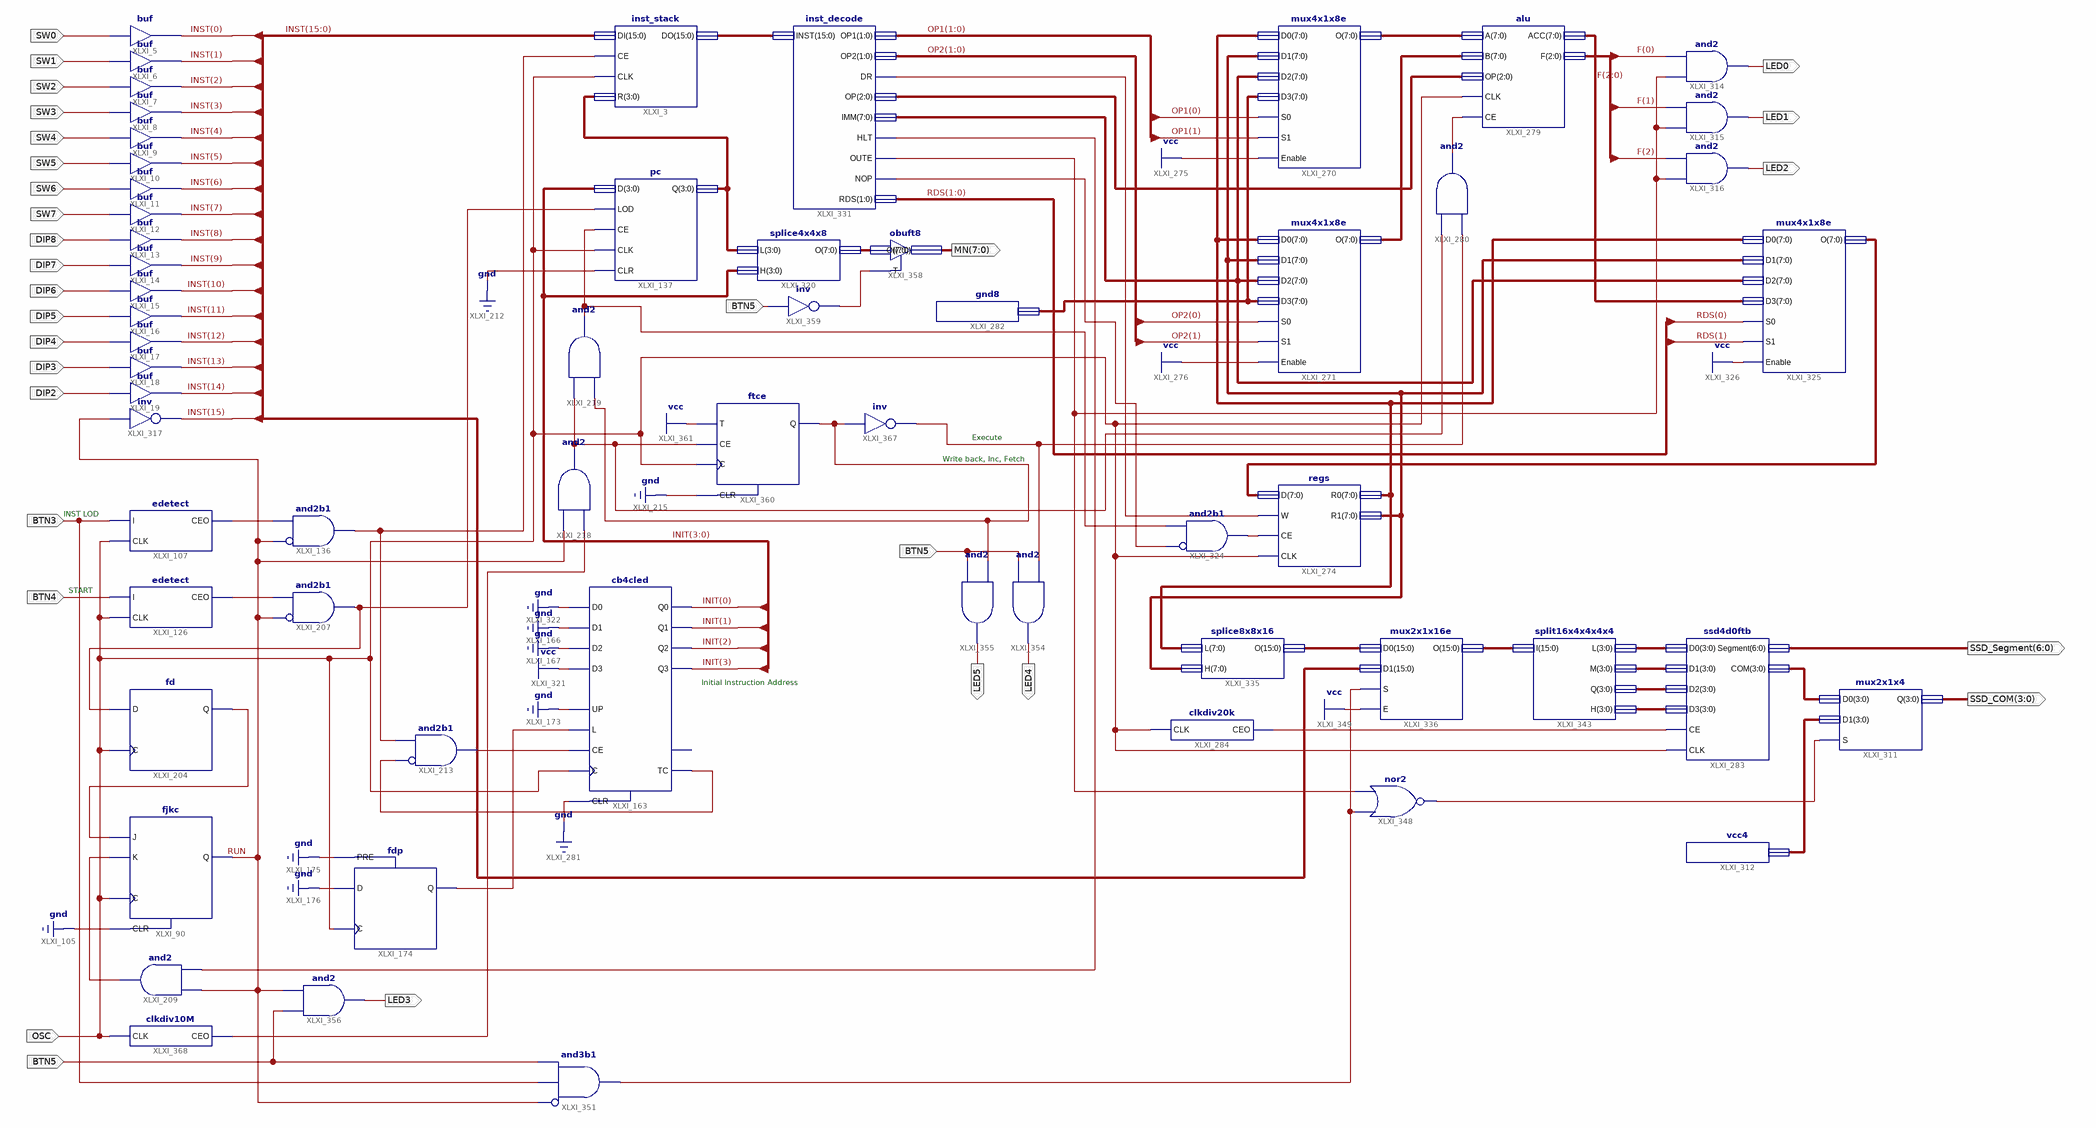
[diagram p0: schematic sheet 1]
// Xilinx ISE schematic main.sch (spartan6) as structural Verilog: 60 symbols, 28 ports
module main (
  input  BTN3,
  input  BTN4,
  input  OSC,
  input  SW0,
  input  SW1,
  input  SW2,
  input  SW3,
  input  SW4,
  input  SW5,
  input  SW7,
  input  DIP7,
  input  DIP6,
  input  DIP5,
  input  DIP4,
  input  DIP3,
  input  DIP2,
  input  DIP8,
  input  SW6,
  input  BTN5,
  output LED0,
  output LED1,
  output LED2,
  output [6:0] SSD_Segment,
  output [3:0] SSD_COM,
  output LED3,
  output [7:0] MN,
  output LED4,
  output LED5
);

  wire LED4P, LED5P, RUN, XLXN_166, XLXN_223, XLXN_230, XLXN_252, XLXN_257, XLXN_271, XLXN_274, XLXN_277,
       XLXN_284, XLXN_285, XLXN_292, XLXN_413, XLXN_419, XLXN_422, XLXN_430, XLXN_496, XLXN_504, XLXN_515,
       XLXN_517, XLXN_556, XLXN_562, XLXN_576;
  wire [1:0] OP1, OP2, RDS;
  wire [2:0] F, XLXN_414;
  wire [3:0] INIT, XLXN_494, XLXN_495, XLXN_514, XLXN_552, XLXN_553, XLXN_554, XLXN_555;
  wire [7:0] XLXN_403, XLXN_405, XLXN_417, XLXN_418, XLXN_426, XLXN_455, XLXN_456, XLXN_518, XLXN_575;
  wire [15:0] INST, XLXN_282, XLXN_528, XLXN_551;

  inst_stack XLXI_3 (.CE(XLXN_223), .CLK(OSC), .DI(INST), .DO(XLXN_282), .R(XLXN_514));
  edetect XLXI_107 (.CEO(XLXN_166), .CLK(OSC), .I(BTN3));
  edetect XLXI_126 (.CEO(XLXN_277), .CLK(OSC), .I(BTN4));
  pc XLXI_137 (.CE(XLXN_430), .CLK(OSC), .CLR(1'b0), .D(INIT), .LOD(XLXN_274), .Q(XLXN_514));
  cb4cled XLXI_163 (
    .C(OSC), .CE(XLXN_257), .CLR(1'b0), .D0(1'b0), .D1(1'b0), .D2(1'b0), .D3(1'b1), .L(XLXN_230), .UP(1'b0),
    .Q0(INIT[0]), .Q1(INIT[1]), .Q2(INIT[2]), .Q3(INIT[3]), .TC(XLXN_252));  // open: CEO
  fjkc XLXI_90 (.C(OSC), .CLR(1'b0), .J(XLXN_271), .K(XLXN_285), .Q(RUN));
  fd XLXI_204 (.C(OSC), .D(XLXN_274), .Q(XLXN_271));
  fdp XLXI_174 (.C(OSC), .D(1'b0), .PRE(1'b0), .Q(XLXN_230));
  and XLXI_207 (XLXN_274, ~RUN, XLXN_277);  // and2b1
  and XLXI_136 (XLXN_223, ~RUN, XLXN_166);  // and2b1
  and XLXI_209 (XLXN_285, XLXN_284, RUN);
  and XLXI_213 (XLXN_257, ~XLXN_252, XLXN_223);  // and2b1
  and XLXI_218 (XLXN_422, XLXN_292, RUN);
  and XLXI_219 (XLXN_430, LED5P, XLXN_422);
  mux4x1x8e XLXI_270 (
    .D0(XLXN_455), .D1(XLXN_456), .D2(XLXN_405), .D3(XLXN_403), .Enable(1'b1), .O(XLXN_417), .S0(OP1[0]),
    .S1(OP1[1]));
  mux4x1x8e XLXI_271 (
    .D0(XLXN_455), .D1(XLXN_456), .D2(XLXN_405), .D3(XLXN_403), .Enable(1'b1), .O(XLXN_418), .S0(OP2[0]),
    .S1(OP2[1]));
  regs XLXI_274 (.CE(XLXN_515), .CLK(OSC), .D(XLXN_518), .R0(XLXN_455), .R1(XLXN_456), .W(XLXN_413));
  alu XLXI_279 (.A(XLXN_417), .ACC(XLXN_426), .B(XLXN_418), .CE(XLXN_419), .CLK(OSC), .F(F), .OP(XLXN_414));
  and XLXI_280 (XLXN_419, LED4P, XLXN_422);
  gnd8 XLXI_282 (.GND(XLXN_403));
  clkdiv20k XLXI_284 (.CEO(XLXN_556), .CLK(OSC));
  buf XLXI_5 (INST[0], SW0);
  buf XLXI_6 (INST[1], SW1);
  buf XLXI_7 (INST[2], SW2);
  buf XLXI_8 (INST[3], SW3);
  buf XLXI_9 (INST[4], SW4);
  buf XLXI_10 (INST[5], SW5);
  buf XLXI_12 (INST[7], SW7);
  buf XLXI_14 (INST[9], DIP7);
  buf XLXI_15 (INST[10], DIP6);
  buf XLXI_16 (INST[11], DIP5);
  buf XLXI_17 (INST[12], DIP4);
  buf XLXI_18 (INST[13], DIP3);
  buf XLXI_19 (INST[14], DIP2);
  buf XLXI_13 (INST[8], DIP8);
  buf XLXI_11 (INST[6], SW6);
  and XLXI_314 (LED0, XLXN_504, F[0]);
  and XLXI_315 (LED1, XLXN_504, F[1]);
  and XLXI_316 (LED2, XLXN_504, F[2]);
  not XLXI_317 (INST[15], RUN);
  splice4x4x8 XLXI_320 (.H(INIT), .L(XLXN_514), .O(XLXN_575));
  and XLXI_324 (XLXN_515, ~XLXN_517, XLXN_430);  // and2b1
  mux4x1x8e XLXI_325 (
    .D0(XLXN_455), .D1(XLXN_456), .D2(XLXN_405), .D3(XLXN_426), .Enable(1'b1), .O(XLXN_518), .S0(RDS[0]),
    .S1(RDS[1]));
  inst_decode XLXI_331 (
    .DR(XLXN_413), .HLT(XLXN_284), .IMM(XLXN_405), .INST(XLXN_282), .NOP(XLXN_517), .OP(XLXN_414), .OP1(OP1),
    .OP2(OP2), .OUTE(XLXN_504), .RDS(RDS));
  splice8x8x16 XLXI_335 (.H(XLXN_456), .L(XLXN_455), .O(XLXN_528));
  mux2x1x16e XLXI_336 (.D0(XLXN_528), .D1(INST), .E(1'b1), .O(XLXN_551), .S(XLXN_562));
  split16x4x4x4x4 XLXI_343 (.H(XLXN_555), .I(XLXN_551), .L(XLXN_552), .M(XLXN_553), .Q(XLXN_554));
  ssd4d0ftb XLXI_283 (
    .CE(XLXN_556), .CLK(OSC), .COM(XLXN_494), .D0(XLXN_552), .D1(XLXN_553), .D2(XLXN_554), .D3(XLXN_555),
    .Segment(SSD_Segment));
  mux2x1x4 XLXI_311 (.D0(XLXN_494), .D1(XLXN_495), .Q(SSD_COM), .S(XLXN_496));
  vcc4 XLXI_312 (.VCC(XLXN_495));
  nor XLXI_348 (XLXN_496, XLXN_562, XLXN_504);
  and XLXI_351 (XLXN_562, ~RUN, BTN3, BTN5);  // and3b1
  and XLXI_356 (LED3, BTN5, RUN);
  obuft8 XLXI_358 (.I(XLXN_575), .T(XLXN_576), .O(MN));
  not XLXI_359 (XLXN_576, BTN5);
  ftce XLXI_360 (.C(OSC), .CE(XLXN_422), .CLR(1'b0), .T(1'b1), .Q(LED5P));
  and XLXI_354 (LED4, BTN5, LED4P);
  and XLXI_355 (LED5, BTN5, LED5P);
  not XLXI_367 (LED4P, LED5P);
  clkdiv10M XLXI_368 (.CEO(XLXN_292), .CLK(OSC));

  // Notes on the sheet:
  //   Execute
  //   Write back, Inc, Fetch
  //   INST LOD
  //   START
  //   Initial Instruction Address
endmodule
